# EAGLE design mDL-Controller-PCB (EAGLE 8.3.2)
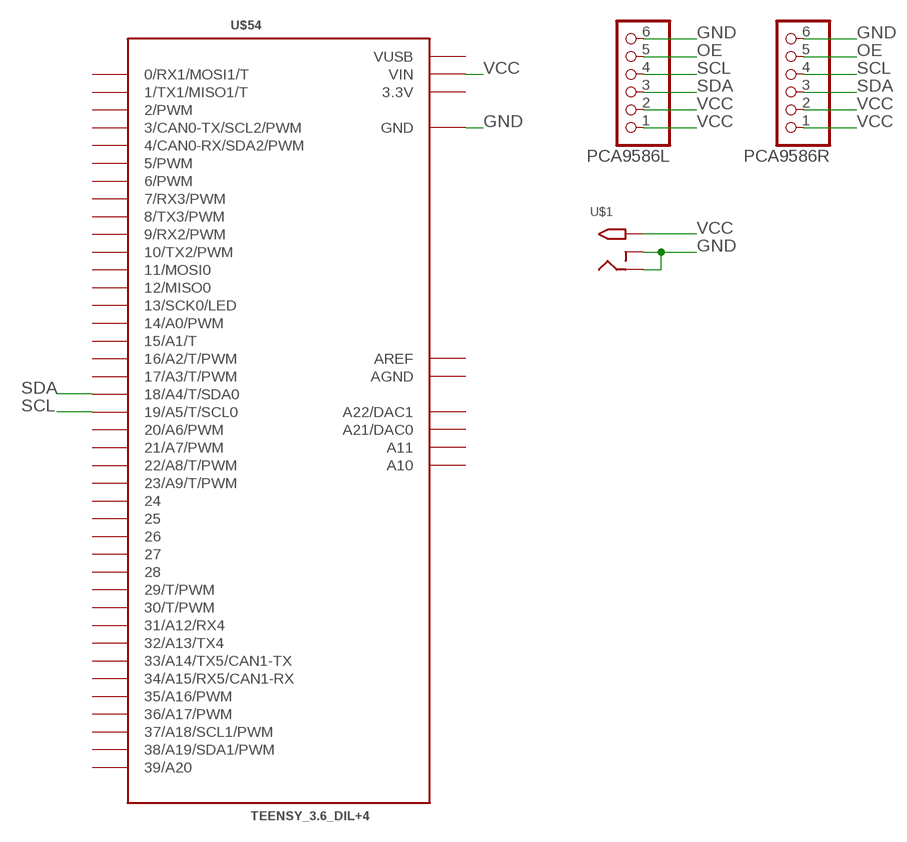
[diagram p0: schematic, sheet 1]

## Parts
PCA9586L  PINHD-1X6B  [1X06-BIG]
PCA9586R  PINHD-1X6B  [1X06-BIG]
U$1  2.1MMJACKTHM  [PJ-102A]
U$54  TEENSY_3.6_DIL+4  [TEENSY_3.6_DIL+4]

## Nets
GND: PCA9586L.6 PCA9586R.6 U$1.RING U$1.RING_SW U$54.GND U$54.GND1(GND)
OE: PCA9586L.5 PCA9586R.5
SCL: PCA9586L.4 PCA9586R.4 U$54.19/A5(19/A5/T/SCL0)
SDA: PCA9586L.3 PCA9586R.3 U$54.18/A4(18/A4/T/SDA0)
VCC: PCA9586L.1 PCA9586L.2 PCA9586R.1 PCA9586R.2 U$1.TIP U$54.VIN
Unconnected: U$54.0(0/RX1/MOSI1/T) U$54.1(1/TX1/MISO1/T) U$54.2(2/PWM) U$54.3(3/CAN0-TX/SCL2/PWM) U$54.4(4/CAN0-RX/SDA2/PWM) U$54.5(5/PWM) U$54.6(6/PWM) U$54.7(7/RX3/PWM) U$54.8(8/TX3/PWM) U$54.9(9/RX2/PWM) U$54.10(10/TX2/PWM) U$54.11(11/MOSI0) U$54.12(12/MISO0) U$54.13(13/SCK0/LED) U$54.14/A0(14/A0/PWM) U$54.15/A1(15/A1/T) U$54.16/A2(16/A2/T/PWM) U$54.17/A3(17/A3/T/PWM) U$54.20/A6(20/A6/PWM) U$54.21/A7(21/A7/PWM) U$54.22/A8(22/A8/T/PWM) U$54.23/A9(23/A9/T/PWM) U$54.24 U$54.25 U$54.26 U$54.27 U$54.28 U$54.29(29/T/PWM) U$54.30(30/T/PWM) U$54.31/A12(31/A12/RX4) U$54.32/A13(32/A13/TX4) U$54.33/A14(33/A14/TX5/CAN1-TX) U$54.34/A15(34/A15/RX5/CAN1-RX) U$54.35/A16(35/A16/PWM) U$54.36/A17(36/A17/PWM) U$54.37/A18(37/A18/SCL1/PWM) U$54.38/A19(38/A19/SDA1/PWM) U$54.39/A20 U$54.A10 U$54.A11 U$54.A21(A21/DAC0) U$54.A22(A22/DAC1)

## Power pins joined to a net without a drawn wire
3.3V: U$54.3.3V U$54.3.3V3(3.3V)
AGND: U$54.AGND
AREF: U$54.AREF
VUSB: U$54.VUSB

## Library data of the parts
PCA9586L PCA9586R = adafruit:PINHD-1X6: PIN HEADER
U$1 = adafruit:2.1MMJACK: 2.1mm x 5.5mm THM DC jack with internal switch. Digikey part #PJ-102A, 4UCON part #05537 2.1mm x 5.5mm SMT DC jack with internal switch. Digikey part #PJ-002A-SMT, 4UCON part #03267 By microbuilder.eu & adafruit.com
U$54 = Teensy_v1.4:TEENSY_3.6_DIL+4: Teensy 3.6 DIL + 4 Pin configuration

## Board
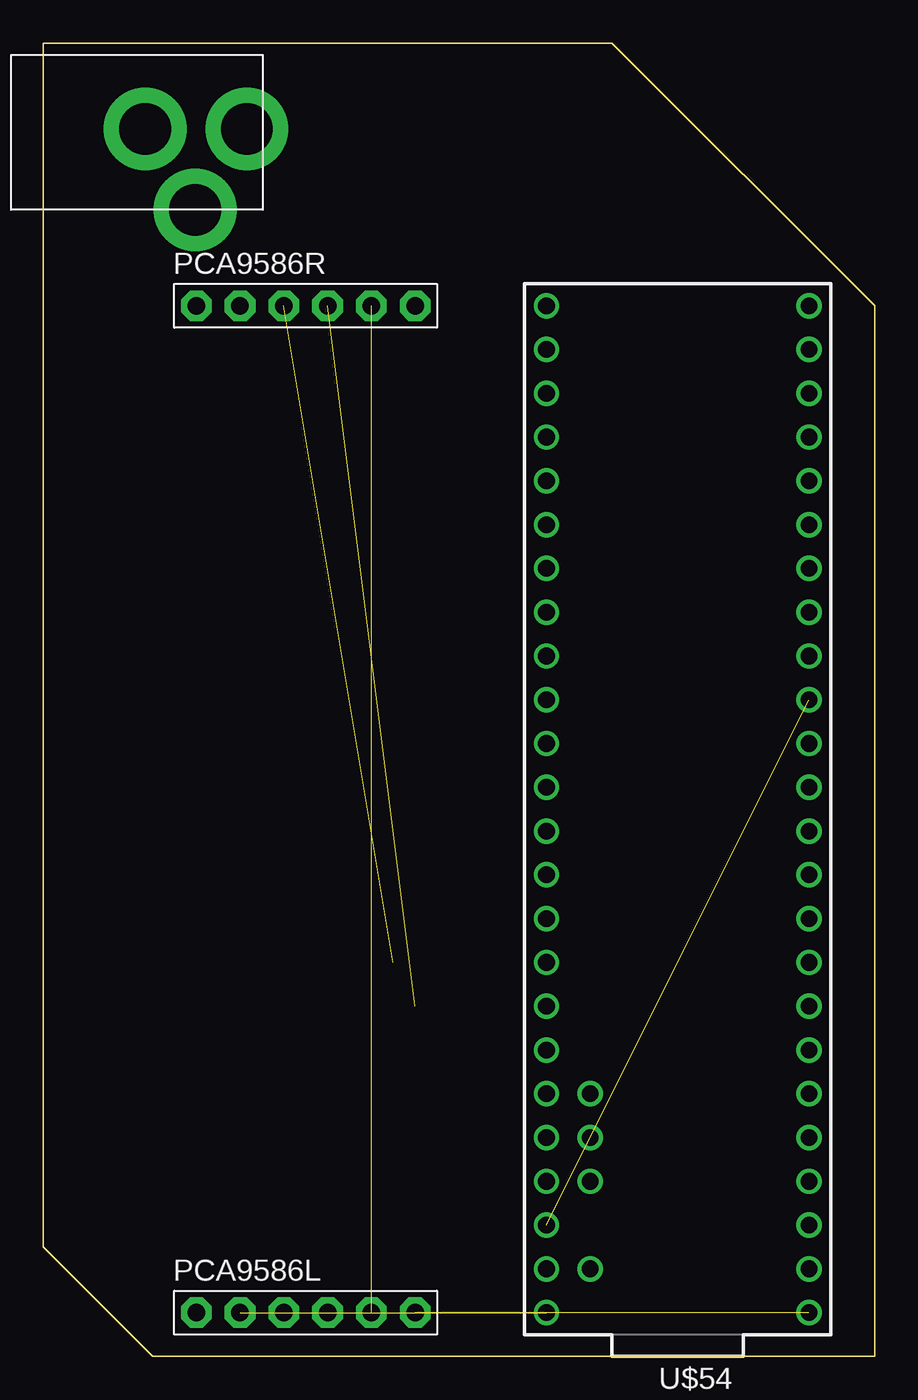
[diagram p1: board, top side]
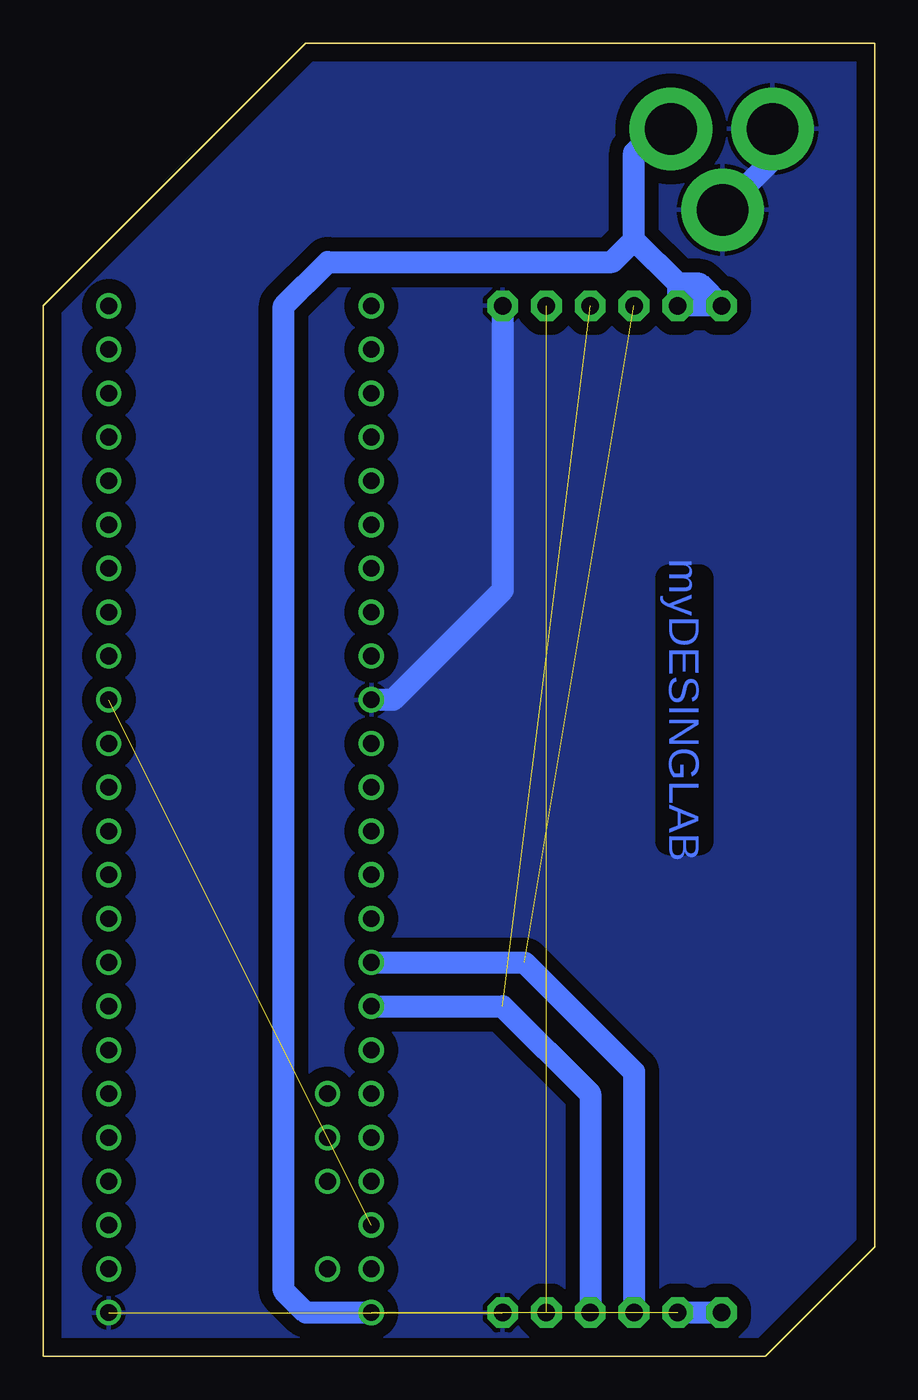
[diagram p2: board, bottom side, seen from below]

Size 48.26 x 76.2 mm. Coordinates in mm from the lower left corner, seen from the top.
Outline: 0,75.87 0,6.35
Outline: 0,6.35 6.35,0 48.26,0 48.26,60.96 33.02,76.2 0,76.2 0,6.35
Copper layers (1*16): Top 0.035mm / dielectric 1.5mm / Text16 0.035mm
Design rules "default": minimum track width 6mil, minimum drill 0.35mm, track to track 6mil, track to pad 6mil, pad to pad 6mil, via to via 6mil, smd to smd 6mil, copper to edge 40mil, drill to drill 6mil, minimum pad ring 10mil, minimum via ring 8mil, stop-mask expansion 4mil, vias tented up to drill 0mil, thermal gap 10mil

### Footprints (pad centres in the part's own frame; a part is rotated, then mirrored left to right if it is on the bottom)
1X06-BIG = drill 1.016 pad 1.778 octagon: 1 -6.35,0; 2 -3.81,0; 3 -1.27,0; 4 1.27,0; 5 3.81,0; 6 6.35,0
PJ-102A = drill 3 pad 4.8: RING 0.1,-3.39; RING_SW -4.6,-6.29; TIP 0.1,-9.29
TEENSY_3.6_DIL+4 = drill 0.965: 0 -7.62,22.86; 1 -7.62,20.32; 2 -7.62,17.78; 3 -7.62,15.24; 3.3V 7.62,20.32; 3.3V3 -7.62,-10.16; 4 -7.62,12.7; 5 -7.62,10.16; 6 -7.62,7.62; 7 -7.62,5.08; 8 -7.62,2.54; 9 -7.62,0; 10 -7.62,-2.54; 11 -7.62,-5.08; 12 -7.62,-7.62; 13 7.62,-7.62; 14/A0 7.62,-5.08; 15/A1 7.62,-2.54; 16/A2 7.62,0; 17/A3 7.62,2.54; 18/A4 7.62,5.08; 19/A5 7.62,7.62; 20/A6 7.62,10.16; 21/A7 7.62,12.7; 22/A8 7.62,15.24; 23/A9 7.62,17.78; 24 -7.62,-12.7; 25 -7.62,-15.24; 26 -7.62,-17.78; 27 -7.62,-20.32; 28 -7.62,-22.86; 29 -7.62,-25.4; 30 -7.62,-27.94; 31/A12 -7.62,-30.48; 32/A13 -7.62,-33.02; 33/A14 7.62,-33.02; 34/A15 7.62,-30.48; 35/A16 7.62,-27.94; 36/A17 7.62,-25.4; 37/A18 7.62,-22.86; 38/A19 7.62,-20.32; 39/A20 7.62,-17.78; A10 5.08,15.24; A11 5.08,12.7; A21 7.62,-15.24; A22 7.62,-12.7; AGND 7.62,22.86; AREF 5.08,17.78; GND -7.62,25.4; GND1 7.62,-10.16; VIN 7.62,25.4; VUSB 5.08,22.86

### Placement (x,y rotation side)
PCA9586L  15.24,2.54 0 top
PCA9586R  15.24,60.96 0 top
U$1  2.54,71.12 90 top
U$54  36.83,27.94 180 top

### Tracks (layer width: path | path; a pad name or v marks a point on that pad's centre or on a via)
3.3V  (1 unrouted)
GND  (1 unrouted)
  Text16 1.27: PCA9586R.6 21.59,44.45 27.94,38.1 U$54.GND1 | U$1.RING 5.93,69.42 U$1.RING_SW
  pour Text16 (isolate 0.813): -2.54,76.84 49.53,76.84 49.53,-3.81 -2.54,-3.81
OE  (1 unrouted)
SCL  (1 unrouted)
  Text16 1.27: U$54.19/A5 21.59,20.32 16.51,15.24 PCA9586L.4
SDA  (1 unrouted)
  Text16 1.27: U$54.18/A4 20.32,22.86 13.97,16.51 PCA9586L.3
VCC  (1 unrouted)
  Text16 1.27: PCA9586L.1 PCA9586L.2 | U$1.TIP 12.6,71.22 13.97,69.85 13.97,64.77 | 11.43,62.23 13.97,64.77 | 11.43,62.23 PCA9586R.2 PCA9586R.1 10.16,62.23 11.43,62.23 | U$54.VIN 33.02,2.54 34.29,3.81 34.29,60.96 31.75,63.5 15.24,63.5 13.97,64.77

### Text on the board
Text16: myDESINGLAB